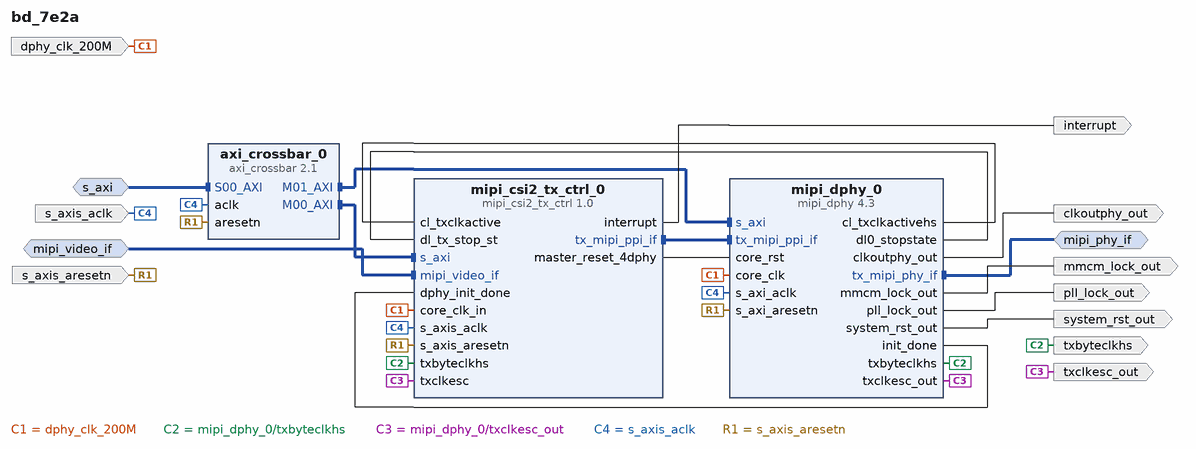
[diagram p0: block diagram of the top level]
# Vivado block design bd_7e2a, xcau25p-ffvb676-2-e, Vivado 2023.1
create_bd_design bd_7e2a

create_bd_intf_port -mode Master -vlnv xilinx.com:interface:mipi_phy_rtl:1.0 mipi_phy_if
create_bd_intf_port -mode Slave -vlnv xilinx.com:interface:aximm_rtl:1.0 s_axi
set_property -dict {CONFIG.ADDR_WIDTH 13 CONFIG.DATA_WIDTH 32 CONFIG.PROTOCOL AXI4LITE} [get_bd_intf_ports s_axi]
create_bd_intf_port -mode Slave -vlnv xilinx.com:interface:mipi_vid_rtl:1.0 mipi_video_if
create_bd_port -dir I -type clk s_axis_aclk
set_property -dict {CONFIG.ASSOCIATED_BUSIF s_axi CONFIG.ASSOCIATED_RESET s_axis_aresetn} [get_bd_ports s_axis_aclk]
create_bd_port -dir I -type rst s_axis_aresetn
set_property -dict {CONFIG.POLARITY ACTIVE_LOW} [get_bd_ports s_axis_aresetn]
create_bd_port -dir I -type clk dphy_clk_200M
create_bd_port -dir O -type clk txbyteclkhs
create_bd_port -dir O -type clk clkoutphy_out
create_bd_port -dir O pll_lock_out
create_bd_port -dir O -type clk txclkesc_out
create_bd_port -dir O system_rst_out
create_bd_port -dir O mmcm_lock_out
create_bd_port -dir O -type intr interrupt

create_bd_cell -type ip -vlnv xilinx.com:ip:mipi_csi2_tx_ctrl:1.0 mipi_csi2_tx_ctrl_0
set_property -dict [list \
  CONFIG.C_CSI_CLK_PRE 1 \
  CONFIG.C_CSI_CRC_ENABLE true \
  CONFIG.C_CSI_DATATYPE RAW8 \
  CONFIG.C_CSI_EN_ACTIVELANES false \
  CONFIG.C_CSI_INIT_DESKEW_PATRN_LEN 4096 \
  CONFIG.C_CSI_LANES 1 \
  CONFIG.C_CSI_LINE_BUFR_DEPTH 4096 \
  CONFIG.C_CSI_MAX_BPC 14 \
  CONFIG.C_CSI_PERIODIC_CNTR_WIDTH 32 \
  CONFIG.C_CSI_PERIODIC_PATRN_LEN 1024 \
  CONFIG.C_CSI_PERIODIC_TIME 5000 \
  CONFIG.C_CSI_PIXEL_MODE 1 \
  CONFIG.C_CSI_VID_INTERFACE Native \
  CONFIG.C_CSI_XMIT_ALT_DESKEW false \
  CONFIG.C_CSI_XMIT_INIT_DESKEW false \
  CONFIG.C_CSI_XMIT_PERIODIC_DESKEW false \
  CONFIG.C_EN_REG_BASED_FE_GEN false \
] [get_bd_cells mipi_csi2_tx_ctrl_0]
create_bd_cell -type ip -vlnv xilinx.com:ip:mipi_dphy:4.3 mipi_dphy_0
set_property -dict [list \
  CONFIG.CLK_LANE_IO_LOC A22 \
  CONFIG.C_CLK_IO_SWAP false \
  CONFIG.C_DL0_IO_SWAP false \
  CONFIG.C_DL1_IO_SWAP false \
  CONFIG.C_DL2_IO_SWAP false \
  CONFIG.C_DL3_IO_SWAP false \
  CONFIG.C_DPHY_LANES 1 \
  CONFIG.C_DPHY_MODE MASTER \
  CONFIG.C_EN_7S_LINERATE_CHECK false \
  CONFIG.C_EN_ACT_LANES false \
  CONFIG.C_EN_DCTS_LOGIC false \
  CONFIG.C_EN_DEBUG_REGS false \
  CONFIG.C_EN_HS_OBUFTDS false \
  CONFIG.C_EN_REG_IF true \
  CONFIG.C_EN_SSC false \
  CONFIG.C_ESC_CLK_PERIOD 10.00 \
  CONFIG.C_HS_LINE_RATE 2500 \
  CONFIG.C_SKEWCAL_FIRST_TIME 4096 \
  CONFIG.C_STRETCH_LINE_RATE 2500 \
  CONFIG.C_XMIT_ALT_DESKEW_SEQ false \
  CONFIG.C_XMIT_FIRST_DESKEW_SEQ false \
  CONFIG.C_XMIT_PERIODIC_DESKEW_SEQ false \
  CONFIG.DATA_LANE0_IO_LOC E21 \
  CONFIG.DPHY_PRESET None \
  CONFIG.HP_IO_BANK_SELECTION 67 \
  CONFIG.SupportLevel 1 \
] [get_bd_cells mipi_dphy_0]
create_bd_cell -type ip -vlnv xilinx.com:ip:axi_crossbar:2.1 axi_crossbar_0
set_property -dict [list \
  CONFIG.ADDR_WIDTH 13 \
  CONFIG.DATA_WIDTH 32 \
  CONFIG.M00_A00_ADDR_WIDTH 12 \
  CONFIG.M00_A00_BASE_ADDR 0x0000000000000000 \
  CONFIG.M01_A00_ADDR_WIDTH 12 \
  CONFIG.M01_A00_BASE_ADDR 0x0000000000001000 \
  CONFIG.NUM_MI 2 \
  CONFIG.PROTOCOL AXI4LITE \
  CONFIG.R_REGISTER 1 \
] [get_bd_cells axi_crossbar_0]

# ---- connections ----

connect_bd_intf_net [get_bd_intf_pins axi_crossbar_0/M00_AXI] [get_bd_intf_pins mipi_csi2_tx_ctrl_0/s_axi]
connect_bd_intf_net [get_bd_intf_pins axi_crossbar_0/M01_AXI] [get_bd_intf_pins mipi_dphy_0/s_axi]
connect_bd_intf_net [get_bd_intf_pins mipi_csi2_tx_ctrl_0/tx_mipi_ppi_if] [get_bd_intf_pins mipi_dphy_0/tx_mipi_ppi_if]
connect_bd_intf_net [get_bd_intf_ports mipi_phy_if] [get_bd_intf_pins mipi_dphy_0/tx_mipi_phy_if]
connect_bd_intf_net [get_bd_intf_ports mipi_video_if] [get_bd_intf_pins mipi_csi2_tx_ctrl_0/mipi_video_if]
connect_bd_intf_net [get_bd_intf_ports s_axi] [get_bd_intf_pins axi_crossbar_0/S00_AXI]
connect_bd_net [get_bd_ports dphy_clk_200M] [get_bd_pins mipi_csi2_tx_ctrl_0/core_clk_in] [get_bd_pins mipi_dphy_0/core_clk]
connect_bd_net [get_bd_pins mipi_csi2_tx_ctrl_0/interrupt] [get_bd_ports interrupt]
connect_bd_net [get_bd_pins mipi_csi2_tx_ctrl_0/master_reset_4dphy] [get_bd_pins mipi_dphy_0/core_rst]
connect_bd_net [get_bd_pins mipi_dphy_0/cl_txclkactivehs] [get_bd_pins mipi_csi2_tx_ctrl_0/cl_txclkactive]
connect_bd_net [get_bd_pins mipi_dphy_0/clkoutphy_out] [get_bd_ports clkoutphy_out]
connect_bd_net [get_bd_pins mipi_dphy_0/dl0_stopstate] [get_bd_pins mipi_csi2_tx_ctrl_0/dl_tx_stop_st]
connect_bd_net [get_bd_pins mipi_dphy_0/init_done] [get_bd_pins mipi_csi2_tx_ctrl_0/dphy_init_done]
connect_bd_net [get_bd_pins mipi_dphy_0/mmcm_lock_out] [get_bd_ports mmcm_lock_out]
connect_bd_net [get_bd_pins mipi_dphy_0/pll_lock_out] [get_bd_ports pll_lock_out]
connect_bd_net [get_bd_pins mipi_dphy_0/system_rst_out] [get_bd_ports system_rst_out]
connect_bd_net [get_bd_pins mipi_dphy_0/txbyteclkhs] [get_bd_pins mipi_csi2_tx_ctrl_0/txbyteclkhs] [get_bd_ports txbyteclkhs]
connect_bd_net [get_bd_pins mipi_dphy_0/txclkesc_out] [get_bd_pins mipi_csi2_tx_ctrl_0/txclkesc] [get_bd_ports txclkesc_out]
connect_bd_net [get_bd_ports s_axis_aclk] \
  [get_bd_pins axi_crossbar_0/aclk] [get_bd_pins mipi_csi2_tx_ctrl_0/s_axis_aclk] [get_bd_pins mipi_dphy_0/s_axi_aclk]
connect_bd_net [get_bd_ports s_axis_aresetn] \
  [get_bd_pins axi_crossbar_0/aresetn] [get_bd_pins mipi_csi2_tx_ctrl_0/s_axis_aresetn] \
  [get_bd_pins mipi_dphy_0/s_axi_aresetn]

# ---- address map ----
assign_bd_address -offset 0x0000 -range 4K -target_address_space [get_bd_addr_spaces s_axi] [get_bd_addr_segs mipi_csi2_tx_ctrl_0/s_axi/reg0]
assign_bd_address -offset 0x1000 -range 4K -target_address_space [get_bd_addr_spaces s_axi] [get_bd_addr_segs mipi_dphy_0/s_axi/Reg]

validate_bd_design
save_bd_design
